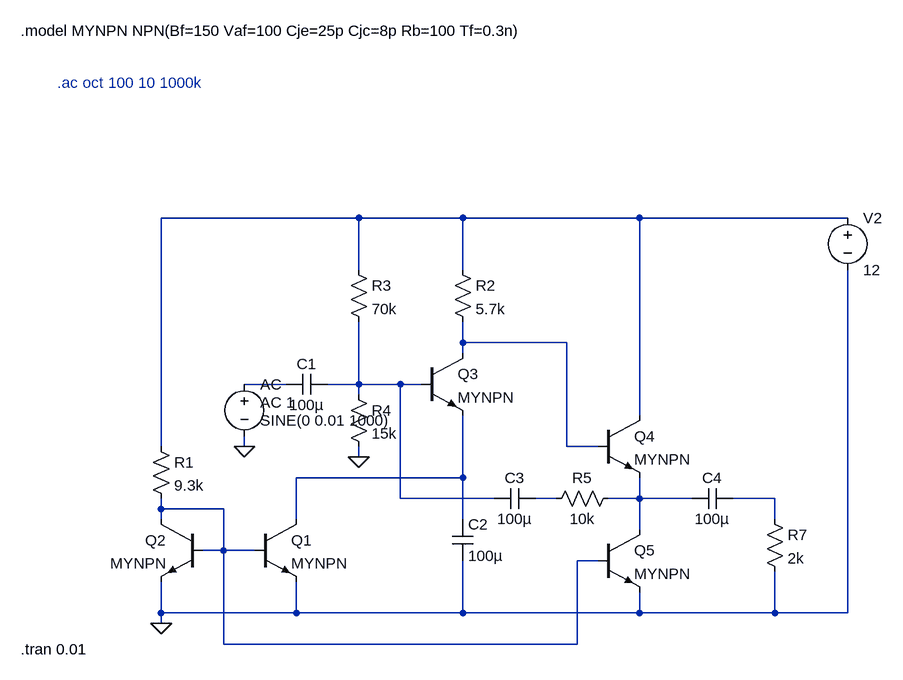
[diagram p0: schematic Draft1.asc]
Draft1.asc, the LTspice schematic file:
Version 4.1
SHEET 1 1176 680
WIRE 368 -352 64 -352
WIRE 528 -352 368 -352
WIRE 800 -352 528 -352
WIRE 1120 -352 800 -352
WIRE 368 -272 368 -352
WIRE 528 -272 528 -352
WIRE 528 -160 528 -192
WIRE 688 -160 528 -160
WIRE 528 -144 528 -160
WIRE 256 -96 192 -96
WIRE 368 -96 368 -192
WIRE 368 -96 320 -96
WIRE 432 -96 368 -96
WIRE 464 -96 432 -96
WIRE 368 -80 368 -96
WIRE 800 -48 800 -352
WIRE 64 0 64 -352
WIRE 192 0 192 -16
WIRE 688 0 688 -160
WIRE 736 0 688 0
WIRE 368 16 368 0
WIRE 528 48 528 -48
WIRE 528 48 272 48
WIRE 432 80 432 -96
WIRE 576 80 432 80
WIRE 672 80 640 80
WIRE 800 80 800 48
WIRE 800 80 752 80
WIRE 880 80 800 80
WIRE 1008 80 944 80
WIRE 64 96 64 80
WIRE 160 96 64 96
WIRE 64 112 64 96
WIRE 272 112 272 48
WIRE 528 112 528 48
WIRE 1008 112 1008 80
WIRE 800 128 800 80
WIRE 160 160 160 96
WIRE 160 160 128 160
WIRE 208 160 160 160
WIRE 736 176 704 176
WIRE 64 256 64 208
WIRE 272 256 272 208
WIRE 272 256 64 256
WIRE 528 256 528 176
WIRE 528 256 272 256
WIRE 800 256 800 224
WIRE 800 256 528 256
WIRE 1008 256 1008 192
WIRE 1008 256 800 256
WIRE 1120 256 1120 -272
WIRE 1120 256 1008 256
WIRE 64 272 64 256
WIRE 160 304 160 160
WIRE 704 304 704 176
WIRE 704 304 160 304
FLAG 64 272 0
FLAG 192 0 0
FLAG 368 16 0
DATAFLAG 176 160 ""
DATAFLAG 64 96 ""
DATAFLAG 624 -352 ""
DATAFLAG 64 -48 "Ic(Q2)"
DATAFLAG 400 -96 ""
DATAFLAG 528 -176 ""
DATAFLAG 688 -144 ""
DATAFLAG 800 -64 ""
DATAFLAG 800 80 ""
DATAFLAG 544 -160 ""
DATAFLAG 192 -96 ""
DATAFLAG 320 48 "Ic(Q1)"
DATAFLAG 192 -96 ""
DATAFLAG 528 0 ""
DATAFLAG 192 -96 ""
SYMBOL res 48 -16 R0
SYMATTR InstName R1
SYMATTR Value 9.3k
SYMBOL res 512 -288 R0
SYMATTR InstName R2
SYMATTR Value 5.7k
SYMBOL res 352 -288 R0
SYMATTR InstName R3
SYMATTR Value 70k
SYMBOL voltage 192 -112 R0
WINDOW 123 24 44 Left 2
WINDOW 39 0 0 Left 0
WINDOW 3 24 72 Left 2
SYMATTR Value2 AC 1
SYMATTR Value SINE(0 0.01 1000)
SYMATTR InstName AC
SYMBOL npn2 208 112 R0
SYMATTR InstName Q1
SYMATTR Value MYNPN
SYMBOL npn2 128 112 M0
SYMATTR InstName Q2
SYMATTR Value MYNPN
SYMBOL npn2 464 -144 R0
SYMATTR InstName Q3
SYMATTR Value MYNPN
SYMBOL npn2 736 -48 R0
SYMATTR InstName Q4
SYMATTR Value MYNPN
SYMBOL res 992 96 R0
SYMATTR InstName R7
SYMATTR Value 2k
SYMBOL cap 944 64 R90
WINDOW 0 0 32 VBottom 2
WINDOW 3 32 32 VTop 2
SYMATTR InstName C4
SYMATTR Value 100µ
SYMBOL cap 320 -112 R90
WINDOW 0 0 32 VBottom 2
WINDOW 3 32 32 VTop 2
SYMATTR InstName C1
SYMATTR Value 100µ
SYMBOL voltage 1120 -368 R0
WINDOW 123 0 0 Left 0
WINDOW 39 0 0 Left 0
SYMATTR InstName V2
SYMATTR Value 12
SYMBOL res 352 -96 R0
SYMATTR InstName R4
SYMATTR Value 15k
SYMBOL cap 512 112 R0
SYMATTR InstName C2
SYMATTR Value 100µ
SYMBOL npn2 736 128 R0
SYMATTR InstName Q5
SYMATTR Value MYNPN
SYMBOL cap 640 64 R90
WINDOW 0 0 32 VBottom 2
WINDOW 3 32 32 VTop 2
SYMATTR InstName C3
SYMATTR Value 100µ
SYMBOL res 768 64 R90
WINDOW 0 0 56 VBottom 2
WINDOW 3 32 56 VTop 2
SYMATTR InstName R5
SYMATTR Value 10k
TEXT -152 -640 Left 2 !.model MYNPN NPN(Bf=150 Vaf=100 Cje=25p Cjc=8p Rb=100 Tf=0.3n)
TEXT -96 -560 Left 2 ;.ac oct 100 10 1000k
TEXT -152 312 Left 2 !.tran 0.01

The netlist it stands for:
* Draft1.asc
R1 N001 N009 9.3k
R2 N001 N002 5.7k
R3 N001 N004 70k
V§AC N003 0 SINE(0 0.01 1000) AC 1
Q1 N005 N009 0 0 MYNPN
Q2 N009 N009 0 0 MYNPN
Q3 N002 N004 N005 0 MYNPN
Q4 N001 N002 N007 0 MYNPN
R7 N008 0 2k
C4 N008 N007 100µ
C1 N004 N003 100µ
V2 N001 0 12
R4 N004 0 15k
C2 N005 0 100µ
Q5 N007 N009 0 0 MYNPN
C3 N006 N004 100µ
R5 N007 N006 10k
.model NPN NPN
.model PNP PNP
.lib standard.bjt
.model MYNPN NPN(Bf=150 Vaf=100 Cje=25p Cjc=8p Rb=100 Tf=0.3n)
* .ac oct 100 10 1000k
.tran 0.01
.backanno
.end